# EAGLE design Arduino Mini (EAGLE 9.6.2)
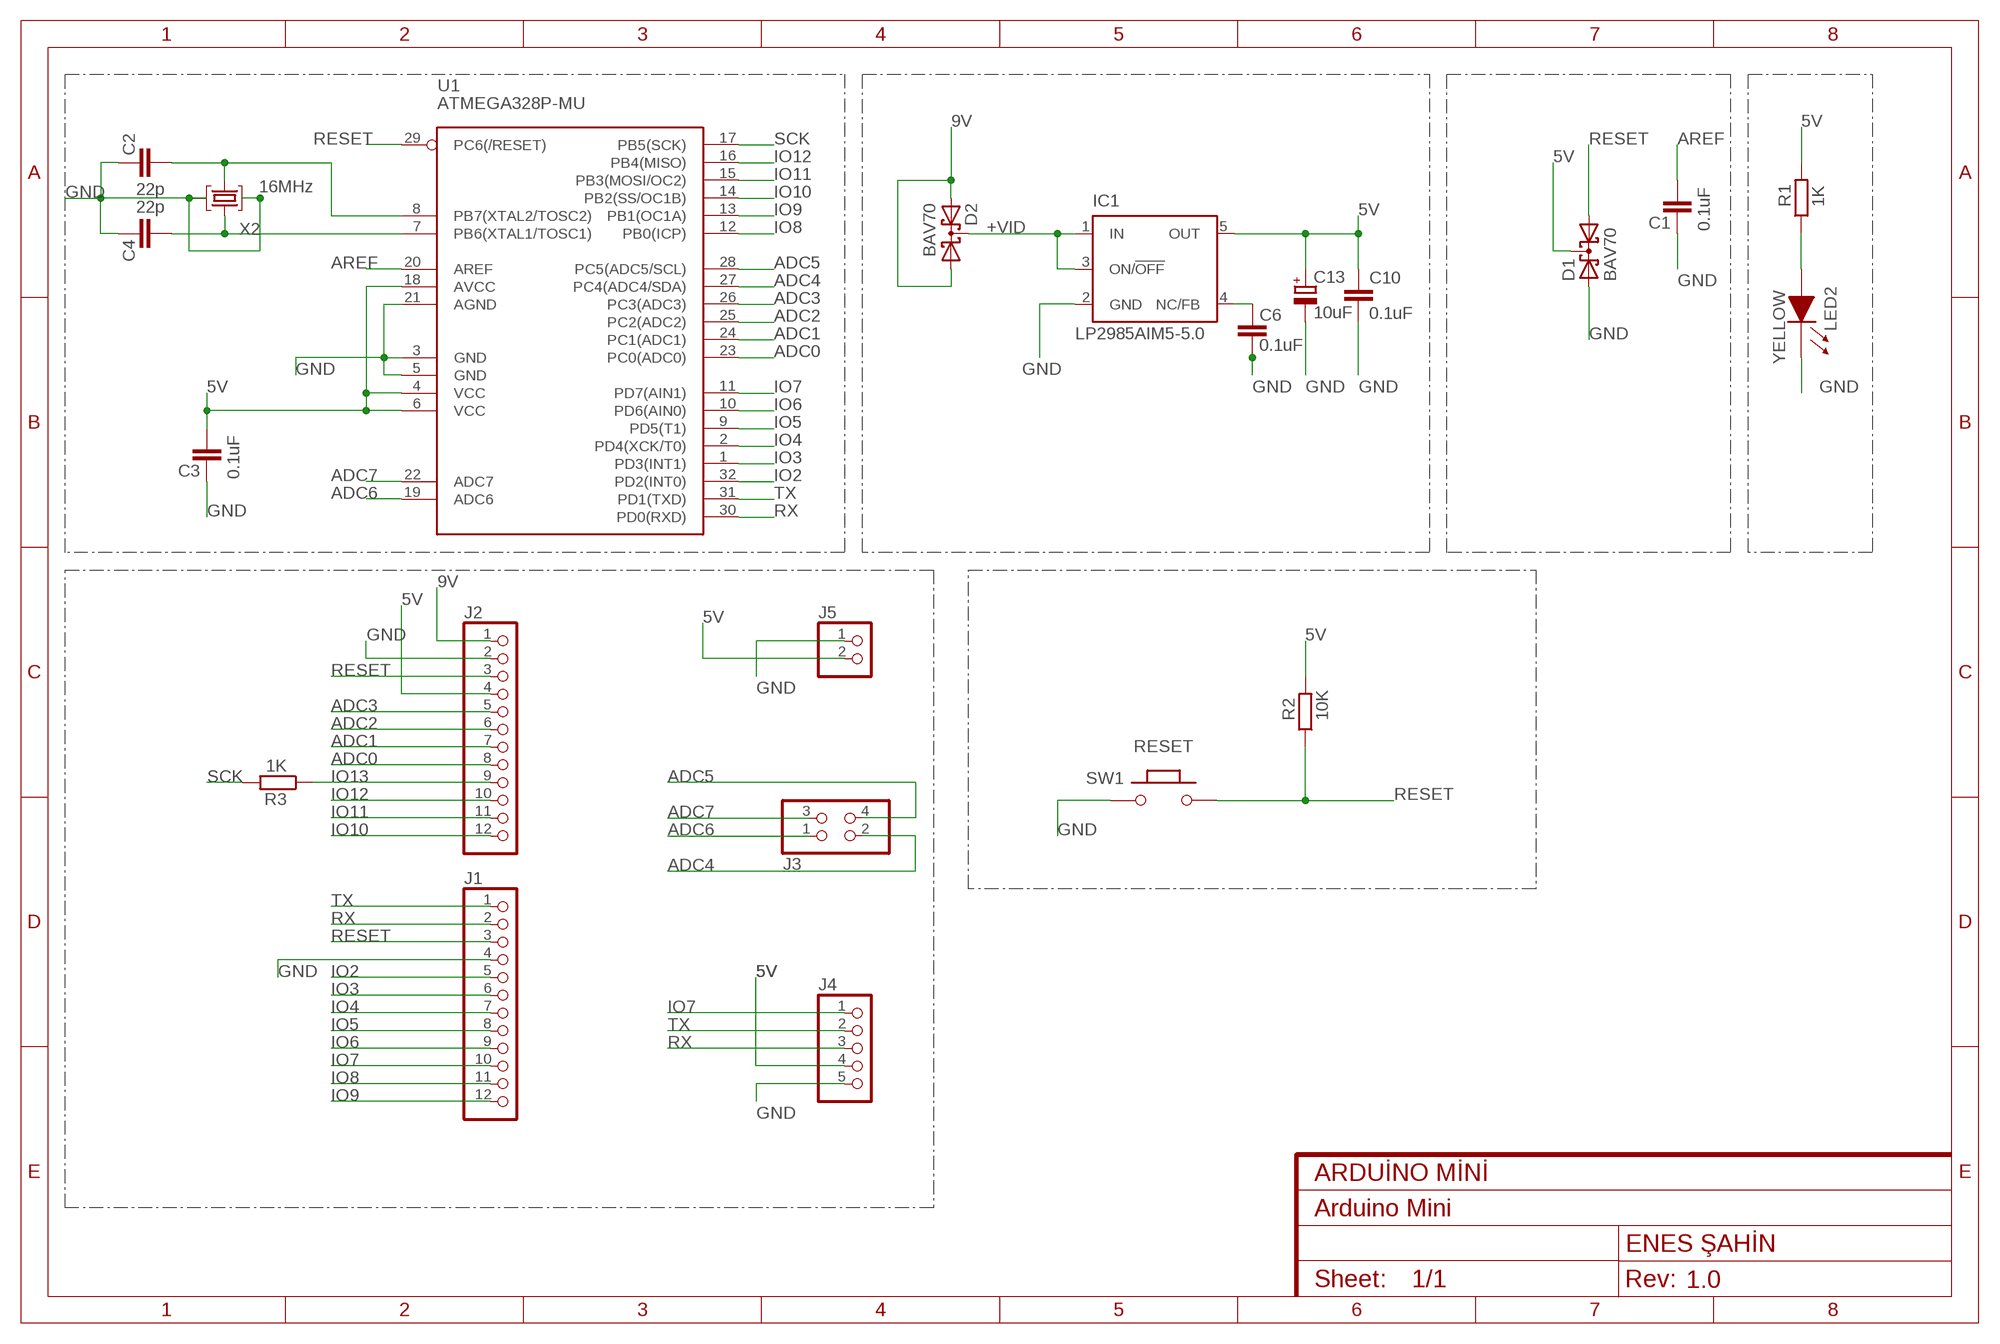
[diagram p0: schematic, sheet 1]
FRAME1 (FRAME-A4L): CNAME: ARDUİNO MİNİ; CREVISION: 1.0; DESIGNER: ENES ŞAHİN

## Parts
C1  0.1uF  C-EUC0603  [C0603-ROUND]
C2  22p  C-EUC0603  [C0603-ROUND]
C3  0.1uF  C-EUC0603  [C0603-ROUND]
C4  22p  C-EUC0603  [C0603-ROUND]
C6  0.1uF  C-EUC0603  [C0603-ROUND]
C10  0.1uF  C-EUC0603  [C0603-ROUND]
C13  10uF  CPOL-EUSMCB  [SMC_B]
D1  BAV70  BAS70-05  [SOT23]
D2  BAV70  BAS70-05  [SOT23]
IC1  LP2985AIM5-5.0  LP2985-XXDBVR50  [SOT23-DBV]
J1  PINHD-1X12  [1X12]
J2  PINHD-1X12  [1X12]
J3  PINHD-2X2  [2X02]
J4  PINHD-1X5  [1X5]
J5  PINHD-1X2  [1X2]
LED2  YELLOW  MYSMD_LED0805  [SMD_LED0805]
R1  1K  R-EU_R0603  [R0603-ROUND]
R2  10K  R-EU_R0603  [R0603-ROUND]
R3  1K  R-EU_R0603  [R0603-ROUND]
SW1  RESET  MYSMD_PB157  [SMD_157SW]
U1  ATMEGA328P-MU  ATMEGAXX8-MU  [MLF32-M1-A]
X2  16MHz  CRYSTAL-3.2-2.5  [CRYSTAL-3.2-2.5]

## Nets
5V: C3.1 C10.1 C13.+ D1.3(C) IC1.5(OUT) J2.4 J4.4 J5.2 R1.2 R2.2 U1.4(VCC) U1.6(VCC) U1.18(AVCC)
9V: D2.1(A1) D2.2(A2) J2.1
+VID: D2.3(C) IC1.1(IN) IC1.3(ON/!OFF)
ADC0: J2.8 U1.23(PC0(ADC0))
ADC1: J2.7 U1.24(PC1(ADC1))
ADC2: J2.6 U1.25(PC2(ADC2))
ADC3: J2.5 U1.26(PC3(ADC3))
ADC4: J3.2 U1.27(PC4(ADC4/SDA))
ADC5: J3.4 U1.28(PC5(ADC5/SCL))
ADC6: J3.1 U1.19(ADC6)
ADC7: J3.3 U1.22(ADC7)
AREF: C1.1 U1.20(AREF)
GND: C1.2 C2.2 C3.2 C4.2 C6.1 C10.2 C13.- D1.1(A1) IC1.2(GND) J1.4 J2.2 J4.5 J5.1 LED2.1(CA) SW1.1 U1.3(GND) U1.5(GND) U1.21(AGND) X2.2(GND) X2.4(GND)
IO2: J1.5 U1.32(PD2(INT0))
IO3: J1.6 U1.1(PD3(INT1))
IO4: J1.7 U1.2(PD4(XCK/T0))
IO5: J1.8 U1.9(PD5(T1))
IO6: J1.9 U1.10(PD6(AIN0))
IO7: J1.10 J4.1 U1.11(PD7(AIN1))
IO8: J1.11 U1.12(PB0(ICP))
IO9: J1.12 U1.13(PB1(OC1A))
IO10: J2.12 U1.14(PB2(SS/OC1B))
IO11: J2.11 U1.15(PB3(MOSI/OC2))
IO12: J2.10 U1.16(PB4(MISO))
IO13: J2.9 R3.1
N$2: C2.1 U1.8(PB7(XTAL2/TOSC2)) X2.3(C2)
N$3: C6.2 IC1.4(NC/FB)
N$4: C4.1 U1.7(PB6(XTAL1/TOSC1)) X2.1(C1)
RESET: D1.2(A2) J1.3 J2.3 R2.1 SW1.2 U1.29(PC6(/RESET))
RESET1: LED2.2(AN) R1.1
RX: J1.2 J4.3 U1.30(PD0(RXD))
SCK: R3.2 U1.17(PB5(SCK))
TX: J1.1 J4.2 U1.31(PD1(TXD))

## Library data of the parts
C1-C4 C6 C10 = Smartprj:C-EU: CAPACITOR, European symbol
C13 = Smartprj:CPOL-EU: POLARIZED CAPACITOR, European symbol
D1 D2 = diode:BAS70-05: Silicon Schottky Diodes General-purpose diode for high-speed switching
IC1 = Smartprj:LP2985-XXDBVR: ULTRALOW-POWER 50-mA LOW-DROPOUT LINEAR REGULATORS 50-mA Low-Dropout Regulator Source: http://focus.ti.com/lit/ds/symlink/tps77001.pdf
J1 J2 = Smartprj:PINHD-1X12: PIN HEADER
J3 = pinhead:PINHD-2X2: PIN HEADER
J4 = Smartprj:PINHD-1X5: PIN HEADER
J5 = LALA1:PINHD-1X2: PIN HEADER
LED2 = Smartprj:MYSMD_LED0805
R1-R3 = Smartprj:R-EU_: RESISTOR, European symbol
SW1 = Smartprj:MYSMD_PB157
U1 = Smartprj:ATMEGAXX8: MICROCONTROLLER 8 Kbytes FLASH 1 kbytes SRAM 512 bytes EEPROM USART 6-channel 10 bit ADC 2-channel 8 bit ADC Source: avr.lbr
X2 = Smartprj:CRYSTAL-3.2-2.5

## Board
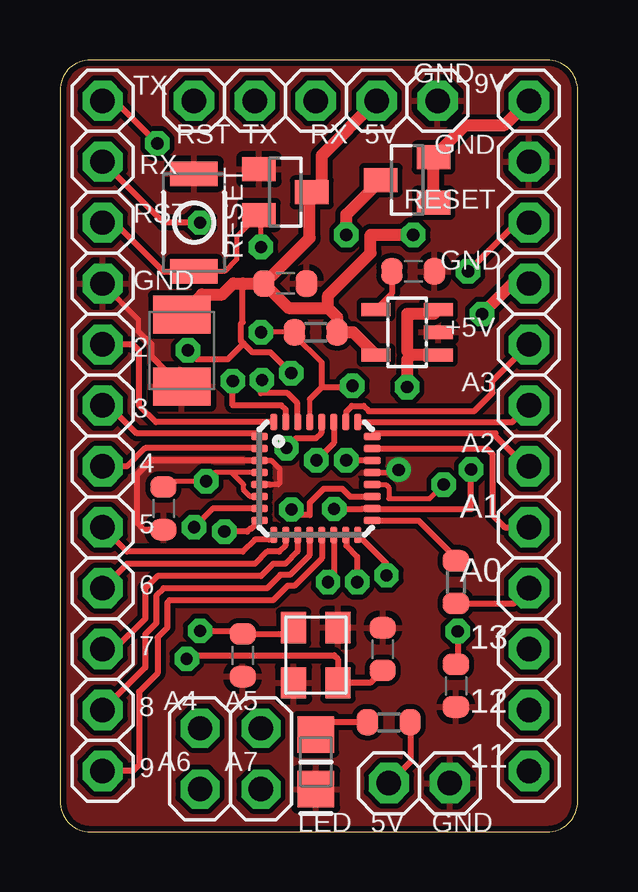
[diagram p1: board, top side]
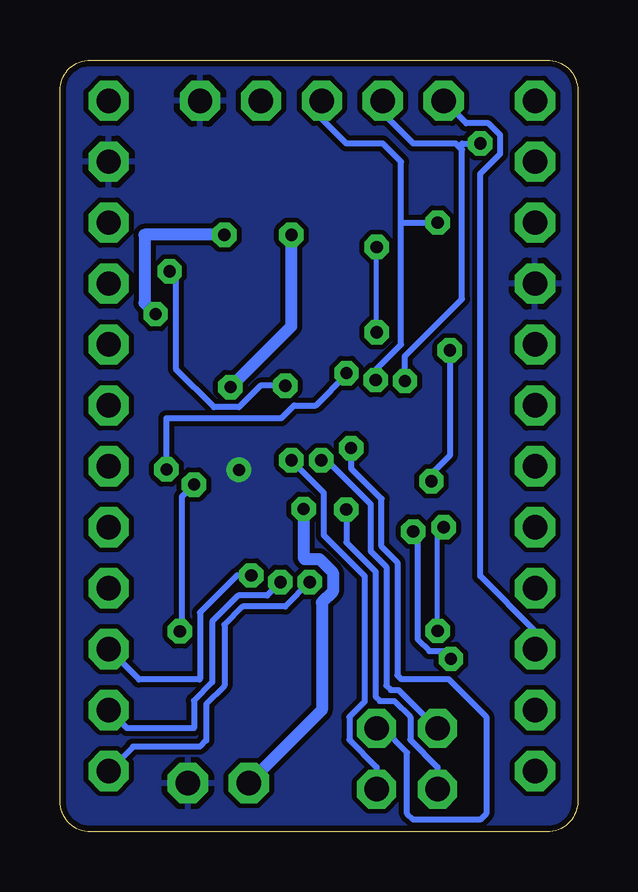
[diagram p2: board, bottom side, seen from below]

Size 21.59 x 32.18 mm. Coordinates in mm from the lower left corner, seen from the top.
Outline: 0,30.91 0,1.27 arc90 1.27,0 20.32,0 arc90 21.59,1.27 21.59,30.91 arc90 20.32,32.18 1.27,32.18 arc90 0,30.91
Copper layers (1*16): Top 0.035mm / dielectric 1.5mm / Bottom 0.035mm
Design rules "SparkFun": minimum track width 8mil, minimum drill 20mil, track to track 8mil, track to pad 8mil, pad to pad 8mil, via to via 8mil, smd to smd 8mil, copper to edge 10mil, drill to drill 8mil, minimum pad ring 12mil, minimum via ring 10mil, stop-mask expansion 4mil, vias tented up to drill 25mil, thermal gap 10mil

### Footprints (pad centres in the part's own frame; a part is rotated, then mirrored left to right if it is on the bottom)
C0603-ROUND = smd 0.898 x 1.1: 1 -0.889,0; 2 0.889,0
SMC_B = smd 1.6 x 2.4: + -1.5,0; - 1.5,0
SOT23 = smd 1 x 1.4: 1 -0.95,-1.1; 2 0.95,-1.1; 3 0,1.1
SOT23-DBV = smd 0.55 x 1.2: 1 -0.95,-1.3; 2 0,-1.3; 3 0.95,-1.3; 4 0.95,1.3; 5 -0.95,1.3
1X12 = drill 1.016 pad 1.676 octagon: 1 -3.81,0; 2 -1.27,0; 3 1.27,0; 4 3.81,0; 5 6.35,0; 6 8.89,0; 7 11.43,0; 8 13.97,0; 9 16.51,0; 10 19.05,0; 11 21.59,0; 12 24.13,0
2X02 = drill 1.016 octagon: 1 -1.27,-1.27; 2 -1.27,1.27; 3 1.27,-1.27; 4 1.27,1.27
1X5 = drill 1.016 pad 1.676 octagon: 1 -3.81,0; 2 -1.27,0; 3 1.27,0; 4 3.81,0; 5 6.35,0
1X2 = drill 1.016 pad 1.676 octagon: 1 -3.81,0; 2 -1.27,0
SMD_LED0805 = smd 1.524 x 1.524: 1 0,0; 2 2.286,0
R0603-ROUND = smd 0.898 x 1.1: 1 -0.889,0; 2 0.889,0
SMD_157SW = smd 1.016 x 1.981: 1 -2.032,0; 2 2.032,0
MLF32-M1-A = smd 0.7 x 0.3: 1 -2.35,1.75; 2 -2.35,1.25; 3 -2.35,0.75; 4 -2.35,0.25; 5 -2.35,-0.25; 6 -2.35,-0.75; 7 -2.35,-1.25; 8 -2.35,-1.75; 17 2.35,-1.75; 18 2.35,-1.25; 19 2.35,-0.75; 20 2.35,-0.25; 21 2.35,0.25; 22 2.35,0.75; 23 2.35,1.25; 24 2.35,1.75 | smd 0.3 x 0.7: 9 -1.75,-2.35; 10 -1.25,-2.35; 11 -0.75,-2.35; 12 -0.25,-2.35; 13 0.25,-2.35; 14 0.75,-2.35; 15 1.25,-2.35; 16 1.75,-2.35; 25 1.75,2.35; 26 1.25,2.35; 27 0.75,2.35; 28 0.25,2.35; 29 -0.25,2.35; 30 -0.75,2.35; 31 -1.25,2.35; 32 -1.75,2.35
CRYSTAL-3.2-2.5 = smd 1.3 x 1.05: 1 -1.15,-0.925; 2 1.15,-0.925; 3 1.15,0.925; 4 -1.15,0.925

### Placement (x,y rotation side)
C1  16.51,6.1 270 top
C2  13.46,7.62 90 top
C3  4.32,13.49 270 top
C4  7.62,7.37 270 top
C6  14.73,23.37 180 top
C10  9.4,22.86 0 top
C13  5.08,20.07 270 top
D1  9.4,26.67 270 top
D2  14.48,27.18 90 top
IC1  14.48,20.83 90 top
J1  1.78,26.67 270 top
J2  19.56,26.67 270 top
J3  7.11,3.05 0 top
J4  9.4,30.48 0 top
J5  12.45,2.03 180 top
LED2  10.67,1.78 90 top
R1  13.72,4.57 0 top
R2  10.67,20.83 0 top
R3  16.51,10.41 90 top
SW1  5.59,25.4 270 top
U1  10.67,14.73 0 top
X2  10.67,7.37 270 top

### Tracks (layer width: path | path; a pad name or v marks a point on that pad's centre or on a via)
5V  (via drill 0.51)
  Top 0.203: 8.36,14.94 U1.4 7.16,14.98 | 7.16,14.98 6.46,14.98 v6.1,14.62 4.56,14.62 C3.1 | 7.16,14.98 7.66,14.48 7.66,14.25 7.93,13.98 U1.6
  Top 0.254: 13,13.46 U1.18 | 13,13.46 12.57,13.46 | R1.2 14.61,2.92 J5.2 | v11.43,13.46 12.57,13.46 | 12.57,13.46 | v17.14,15.11 17.14,13.46 13,13.46 | 7.66,20.36 8.04,19.99 8.78,19.99 v9.64,19.13 | 7.66,20.36 7.54,20.48 7.54,21.17 7.62,21.25 7.62,22.86 | 7.66,20.36 7,19.7 5.71,19.7 v5.33,20.08
  Top 0.508: C13.+ 5.92,22.4 6.77,22.4 7.22,22.86 7.62,22.86 C10.1 | IC1.5 12.23,20.83 R2.2 11.56,21.46 11.18,21.84 | C10.1 10.41,24.77 10.41,26.59 D1.3 10.92,27.09 10.92,28.19 J4.4 | C10.1 9.53,21.84 11.18,21.84 | 11.18,21.84 11.18,22.31 11.19,22.33 11.19,22.37 12.95,24.13 12.95,24.89 v14.73,24.89 | v17.6,21.59 18.87,22.86 J2.4
  Bottom 0.254: v17.14,15.11 17.14,17.25 12.36,17.25 11.83,17.78 10.92,17.78 9.64,19.06 v9.64,19.13 | v5.33,20.08 5.33,15.68 6.1,14.92 v6.1,14.62
  Bottom 0.508: v11.43,13.46 11.43,11.43 11.38,11.38 10.78,11.38 10.21,10.81 10.21,10.01 10.67,9.56 10.67,5.08 J5.2 | v14.73,24.89 18.06,24.89 18.06,22.05 v17.6,21.59
9V
  Top 0.508: D2.1 D2.2 16.91,29.46 18.54,29.46 J2.1
+VID  (via drill 0.51)
  Top 0.508: IC1.3 15.59,21.59 14.48,21.59 14.48,20.07 14.67,19.88 | IC1.1 14.67,19.88 | 14.67,19.88 14.48,19.69 v14.48,18.54 | v11.94,24.89 11.94,25.74 D2.3
  Bottom 0.508: v14.48,18.54 11.94,21.08 v11.94,24.89
ADC0
  Top 0.254: U1.23 17.8,15.98 18.03,15.75 18.03,13.21 18.54,12.7 J2.8
ADC1
  Top 0.254: U1.24 13.16,16.62 18.03,16.62 | 18.03,16.62 18.17,16.62 | 18.03,16.62 19.42,15.24 J2.7
ADC2
  Top 0.254: U1.25 18.86,17.08 J2.6
ADC3
  Top 0.254: U1.26 11.94,17.1 11.94,17.52 12.17,17.76 12.66,17.76 12.88,17.54 17.27,17.54 18.03,18.3 18.03,18.8 J2.5
ADC4  (via drill 0.51)
  Top 0.254: v10.69,15.49 11.42,16.22 U1.27
  Bottom 0.254: v10.69,15.49 10.46,15.49 8.64,13.66 8.64,11.71 7.98,11.05 7.98,6.1 7.8,5.92 7.46,5.92 5.87,4.32 J3.2
ADC5  (via drill 0.51)
  Top 0.254: U1.28 10.9,17.06 10.9,16.64 10.66,16.4 9.85,16.4 v9.45,16
  Bottom 0.254: v9.45,16 9.45,15.15 8.18,13.88 8.18,11.9 7.52,11.24 7.52,6.53 7.37,6.38 5.38,6.38 3.81,4.8 3.81,0.76 4.06,0.51 6.86,0.51 7.11,0.76 7.11,3.3 8.13,4.32 J3.4
ADC6  (via drill 0.51)
  Top 0.254: U1.19 13.01,13.97 12.11,13.97 11.78,14.3 11,14.3 10.41,13.72 10.41,13.21 9.89,13.21 v9.65,13.44
  Bottom 0.254: v9.65,13.44 9.65,12.08 8.43,10.86 8.43,5.64 8.25,5.46 7.65,5.46 6.98,4.79 6.98,3.84 5.84,2.7 J3.1
ADC7  (via drill 0.51)
  Top 0.254: U1.22 12.25,15.48 12.24,15.49 v11.94,15.49
  Bottom 0.254: v11.94,15.49 10.59,14.15 10.59,12.37 8.89,10.67 8.89,5.43 9.53,4.79 9.53,3.84 8.38,2.7 J3.3
AREF  (via drill 0.51)
  Top 0.203: v16,14.47 15.42,13.89 13.72,13.89 13.72,14.35 13.58,14.48 U1.20
  Top 0.254: v16,14.47 v16,14.48 | v16.59,8.36 16.59,7.06 C1.1
  Bottom 0.254: v16,14.48 16.51,13.97 16.51,8.44 v16.59,8.36
GND  (via drill 0.51)
  Top 0.203: 13.06,14.94 U1.21 14.02,14.98 v14.13,15.09 | J1.4 3.27,21.37 3.27,20.87 | U1.3 8.82,15.48 9.16,15.14 9.16,14.54 9.1,14.48 8.76,14.48
  Top 0.254: U1.3 3.8,15.48 3.22,14.91 3.22,12.87 3.5,12.6 C3.2 | 8.76,14.48 U1.5 | 3.27,20.87 3.8,20.33 3.8,19.84 C13.- 5.09,18.55
  pour Top: -1.02,33.02 22.61,33.02 22.61,-0.25 -1.02,-0.25
  pour Bottom: -0.76,33.27 22.86,33.27 22.86,-0.51 -1.27,-0.51 -1.27,33.27
IO2
  Top 0.254: U1.32 4,17.08 3.3,17.78 3.3,20.07 3.05,20.32 J1.5
IO3
  Top 0.254: U1.1 8.19,16.61 3.2,16.61 2.03,17.78 J1.6
IO4
  Top 0.254: U1.2 8.3,16 3.56,16 2.79,15.24 J1.7
IO5
  Top 0.254: U1.9 8.73,12.19 8.13,12.19 7.62,11.68 2.79,11.68 J1.8
IO6
  Top 0.254: U1.10 9.4,12.36 9.4,11.94 | 9.4,11.94 | 9.4,11.94 9.14,11.68 8.64,11.68 8.13,11.18 2.79,11.18 J1.9
IO7
  Top 0.254: U1.11 9.91,12.37 9.91,11.68 9.4,11.18 8.89,11.18 8.38,10.67 4.06,10.67 3.56,10.16 3.56,8.89 2.29,7.62 J1.10
  Bottom 0.254: J1.10 1.78,8.38 4.06,10.67 4.06,27.43 3.23,28.27 3.23,29.05 3.72,29.54 4.65,29.54 J4.1
IO8
  Top 0.254: U1.12 10.4,12.36 10.4,11.53 9.59,10.72 9.2,10.72 8.64,10.16 4.32,10.16 4.01,9.86 4.01,8.7 3.56,8.24 3.56,6.86 J1.11
IO9
  Top 0.254: U1.13 10.92,11.4 9.78,10.26 9.5,10.26 8.89,9.65 4.57,9.65 4.47,9.55 4.47,8.51 4.06,8.11 4.06,6.6 3.3,5.84 3.3,2.79 3.05,2.54 J1.12
IO10  (via drill 0.51)
  Top 0.254: U1.14 11.42,10.66 v11.18,10.41
  Bottom 0.254: v11.18,10.41 12.19,9.4 13.97,9.4 14.73,8.64 14.73,6.1 15.49,5.33 15.49,3.81 15.75,3.56 18.54,3.56 J2.12
IO11  (via drill 0.51)
  Top 0.254: U1.15 11.94,12.36 11.94,11.94 12.39,11.48 v12.39,10.41
  Bottom 0.254: v12.39,10.41 12.95,9.86 14.16,9.86 15.24,8.77 15.24,6.23 16,5.47 16,4.32 18.8,4.32 J2.11
IO12  (via drill 0.51)
  Top 0.254: U1.16 13.61,11.19 v13.61,10.69
  Bottom 0.254: v13.61,10.69 14.2,10.69 15.75,9.14 15.75,6.37 15.77,6.35 18.29,6.35 J2.10
IO13
  Top 0.254: R3.1 18.92,9.52 J2.9
N$2  (via drill 0.51)
  Top 0.254: C2.1 12.95,6.22 X2.3 11.59,7.2 11.43,7.37 5.44,7.37 v5.29,7.21 | U1.8 7.98,12.65 7.94,12.65 7.81,12.52 v6.86,12.52
  Bottom 0.254: v5.29,7.21 5.62,7.54 6.19,7.54 6.68,8.03 6.68,12.34 v6.86,12.52
N$3
  Top 0.254: C6.2 13.84,22.44 IC1.4
N$4  (via drill 0.51)
  Top 0.254: X2.1 9.48,8.25 C4.1 7.49,8.38 v5.84,8.38 | U1.7 6.37,13.48 v5.59,12.7
  Bottom 0.203: v5.84,8.38 5.84,12.45 v5.59,12.7
RESET  (via drill 0.51)
  Top 0.203: v8.38,20.83 R2.1 9.78,20.7 10.92,19.56 | v8.38,24.38 8.38,25.64 D1.2 7.37,24.79 7.37,23.88 6.86,23.37 SW1.2 | U1.29 10.42,18.04
  Top 0.254: J1.3 2.29,25.4 4.32,23.37 SW1.2 | 10.42,18.04 10.92,18.54 | 10.92,18.54 10.92,19.56 | 10.92,18.54 12.13,18.54 v12.19,18.6 | v17.02,23.37 19.05,25.4 J2.3
  Bottom 0.203: v8.38,20.83 v8.38,24.38
  Bottom 0.254: v12.19,18.6 13.23,18.6 14.13,17.7 15.16,17.7 16.76,19.3 16.76,23.11 v17.02,23.37 | 19.05,25.4 J2.3
RESET1
  Top 0.254: R1.1 11.18,4.57 LED2.2
RX  (via drill 0.51)
  Top 0.254: U1.30 9.9,17.1 9.9,17.87 9.48,18.29 8.38,18.29 8.38,18.8 v8.42,18.84 | v5.84,25.4 4.32,25.4 J1.2
  Bottom 0.254: v8.42,18.84 8.42,19.26 7.37,20.32 7.37,25.4 | 7.37,25.4 7.37,27.94 8.13,28.7 9.65,28.7 10.67,29.72 J4.3 | 7.37,25.4 v5.84,25.4
SCK
  Top 0.254: U1.17 14.96,12.98 16.51,11.43 R3.2
TX  (via drill 0.51)
  Top 0.254: U1.31 9.42,17.6 9.24,17.78 7.21,17.78 v7.21,18.8 | v4.06,28.7 2.29,30.48 J1.1
  Bottom 0.254: v7.21,18.8 7.21,19.83 4.83,22.21 4.83,28.45 4.95,28.58 | 4.95,28.58 5.08,28.7 6.86,28.7 8.13,29.97 J4.2 | 4.95,28.58 4.83,28.7 v4.06,28.7

### Text on the board
tPlace: GND | 9V | TX | RST | TX | RX | 5V | GND | RX | RESET | RST | GND | RESET | GND | +5V | 2 | A3 | 3 | A2 | 4 | A1 | 5 | A0 | 6 | 13 | 7 | 12 | 8 | A4 | A5 | 11 | 9 | A6 | A7 | LED | 5V | GND